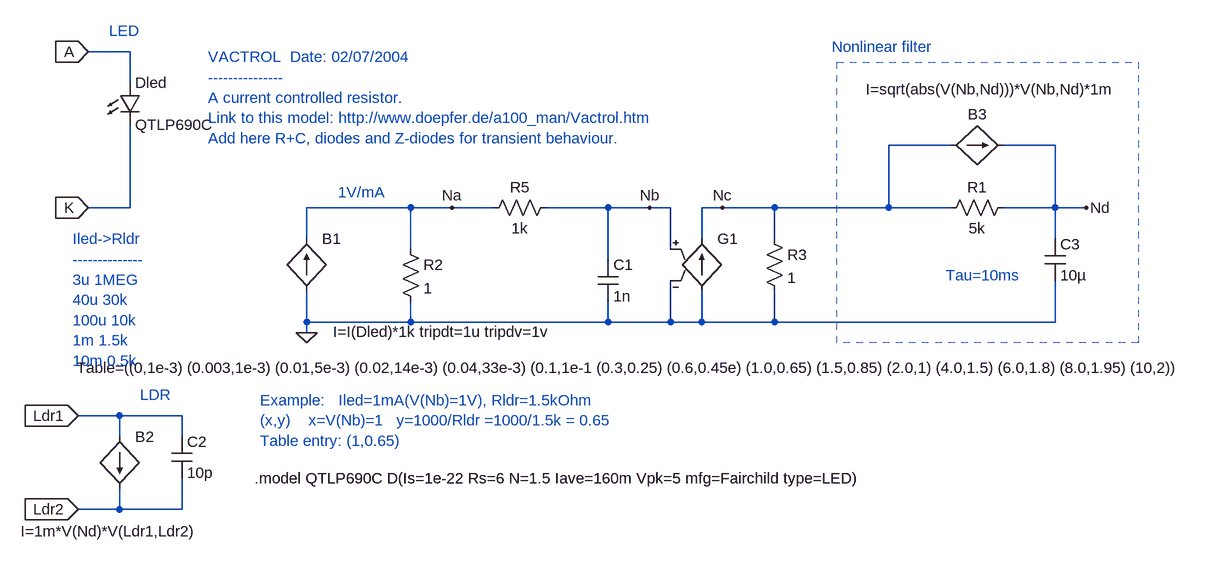
[diagram p0: schematic led_ldr.asc]
led_ldr.asc, the LTspice schematic file:
Version 4
SHEET 1 1968 680
WIRE -752 -496 -816 -496
WIRE -752 -448 -752 -496
WIRE 512 -352 416 -352
WIRE 672 -352 592 -352
WIRE -752 -256 -752 -384
WIRE -752 -256 -816 -256
WIRE -320 -256 -480 -256
WIRE -256 -256 -320 -256
WIRE -192 -256 -256 -256
WIRE -16 -256 -112 -256
WIRE 48 -256 -16 -256
WIRE 80 -256 48 -256
WIRE 160 -256 128 -256
WIRE 240 -256 160 -256
WIRE 416 -256 416 -352
WIRE 416 -256 240 -256
WIRE 512 -256 416 -256
WIRE 672 -256 672 -352
WIRE 672 -256 592 -256
WIRE 720 -256 672 -256
WIRE -480 -208 -480 -256
WIRE 128 -208 128 -256
WIRE 240 -208 240 -256
WIRE 672 -208 672 -256
WIRE -320 -192 -320 -256
WIRE 80 -192 80 -256
WIRE -16 -176 -16 -256
WIRE -480 -80 -480 -128
WIRE -320 -80 -320 -112
WIRE -320 -80 -480 -80
WIRE -16 -80 -16 -112
WIRE -16 -80 -320 -80
WIRE 80 -80 80 -144
WIRE 80 -80 -16 -80
WIRE 128 -80 128 -128
WIRE 128 -80 80 -80
WIRE 240 -80 240 -128
WIRE 240 -80 128 -80
WIRE 672 -80 672 -144
WIRE 672 -80 240 -80
WIRE -480 -64 -480 -80
WIRE -768 64 -832 64
WIRE -672 64 -768 64
WIRE -768 96 -768 64
WIRE -672 96 -672 64
WIRE -768 208 -768 176
WIRE -768 208 -832 208
WIRE -672 208 -672 160
WIRE -672 208 -768 208
FLAG -480 -64 0
FLAG -256 -256 Na
FLAG 720 -256 Nd
FLAG -832 64 Ldr1
IOPIN -832 64 In
FLAG -832 208 Ldr2
IOPIN -832 208 In
FLAG -816 -496 A
IOPIN -816 -496 In
FLAG -816 -256 K
IOPIN -816 -256 In
FLAG 48 -256 Nb
FLAG 160 -256 Nc
SYMBOL res -336 -208 R0
SYMATTR InstName R2
SYMATTR Value 1
SYMBOL bi2 -480 -208 R0
WINDOW 3 41 143 Left 0
SYMATTR Value I=I(Dled)*1k tripdt=1u tripdv=1v
SYMATTR InstName B1
SYMBOL LED -768 -448 R0
SYMATTR InstName Dled
SYMATTR Value QTLP690C
SYMBOL cap -32 -176 R0
SYMATTR InstName C1
SYMATTR Value 1n
SYMBOL g 128 -224 R0
WINDOW 3 -962 214 Left 0
SYMATTR Value Table=((0,1e-3) (0.003,1e-3) (0.01,5e-3) (0.02,14e-3) (0.04,33e-3) (0.1,1e-1 (0.3,0.25) (0.6,0.45e) (1.0,0.65) (1.5,0.85) (2.0,1) (4.0,1.5) (6.0,1.8) (8.0,1.95) (10,2))
SYMATTR InstName G1
SYMBOL res 224 -224 R0
SYMATTR InstName R3
SYMATTR Value 1
SYMBOL bi -768 96 R0
WINDOW 3 -152 146 Left 0
SYMATTR Value I=1m*V(Nd)*V(Ldr1,Ldr2)
SYMATTR InstName B2
SYMBOL cap -688 96 R0
SYMATTR InstName C2
SYMATTR Value 10p
SYMBOL cap 656 -208 R0
SYMATTR InstName C3
SYMATTR Value 10µ
SYMBOL res -208 -240 R270
WINDOW 0 32 56 VTop 0
WINDOW 3 0 56 VBottom 0
SYMATTR InstName R5
SYMATTR Value 1k
SYMBOL res 496 -240 R270
WINDOW 0 32 56 VTop 0
WINDOW 3 0 56 VBottom 0
SYMATTR InstName R1
SYMATTR Value 5k
SYMBOL bi 512 -352 R270
WINDOW 0 32 40 VTop 0
WINDOW 3 102 62 VBottom 0
SYMATTR InstName B3
SYMATTR Value I=sqrt(abs(V(Nb,Nd)))*V(Nb,Nd)*1m
TEXT -840 -208 Left 0 ;Iled->Rldr\n--------------\n3u 1MEG\n40u 30k\n100u 10k\n1m 1.5k\n10m 0.5k
TEXT -432 -280 Left 0 ;1V/mA
TEXT -552 40 Left 0 ;Example:   Iled=1mA(V(Nb)=1V), Rldr=1.5kOhm\n(x,y)    x=V(Nb)=1   y=1000/Rldr =1000/1.5k = 0.65\nTable entry: (1,0.65)
TEXT 504 -152 Left 0 ;Tau=10ms
TEXT 328 -504 Left 0 ;Nonlinear filter
TEXT -736 32 Left 0 ;LDR
TEXT -784 -528 Left 0 ;LED
TEXT -632 -488 Left 0 ;VACTROL  Date: 02/07/2004\n---------------\nA current controlled resistor.\nLink to this model: http://www.doepfer.de/a100_man/Vactrol.htm\nAdd here R+C, diodes and Z-diodes for transient behaviour.
TEXT -560 160 Left 0 !.model QTLP690C D(Is=1e-22 Rs=6 N=1.5 Iave=160m Vpk=5 mfg=Fairchild type=LED)
RECTANGLE Normal 800 -48 336 -480 2

The netlist it stands for:
* led_ldr.asc
R2 Na 0 1
B1 0 Na I=I(Dled)*1k tripdt=1u tripdv=1v
Dled A K QTLP690C
C1 Nb 0 1n
G1 0 Nc Nb 0 Table=((0,1e-3) (0.003,1e-3) (0.01,5e-3) (0.02,14e-3) (0.04,33e-3) (0.1,1e-1 (0.3,0.25) (0.6,0.45e) (1.0,0.65) (1.5,0.85) (2.0,1) (4.0,1.5) (6.0,1.8) (8.0,1.95) (10,2))
R3 Nc 0 1
B2 Ldr1 Ldr2 I=1m*V(Nd)*V(Ldr1,Ldr2)
C2 Ldr1 Ldr2 10p
C3 Nd 0 10µ
R5 Na Nb 1k
R1 Nc Nd 5k
B3 Nc Nd I=sqrt(abs(V(Nb,Nd)))*V(Nb,Nd)*1m
.model D D
.lib standard.dio
* Iled->Rldr
* --------------
* 3u 1MEG
* 40u 30k
* 100u 10k
* 1m 1.5k
* 10m 0.5k
* 1V/mA
* Example:   Iled=1mA(V(Nb)=1V), Rldr=1.5kOhm
* (x,y)    x=V(Nb)=1   y=1000/Rldr =1000/1.5k = 0.65
* Table entry: (1,0.65)
* Tau=10ms
* Nonlinear filter
* LDR
* LED
* VACTROL  Date: 02/07/2004
* ---------------
* A current controlled resistor.
* Link to this model: http://www.doepfer.de/a100_man/Vactrol.htm
* Add here R+C, diodes and Z-diodes for transient behaviour.
.model QTLP690C D(Is=1e-22 Rs=6 N=1.5 Iave=160m Vpk=5 mfg=Fairchild type=LED)
.backanno
.end